# Altium schematic sheet Sheet_1_2022-06-09.schdoc
size 54 x 32 mm
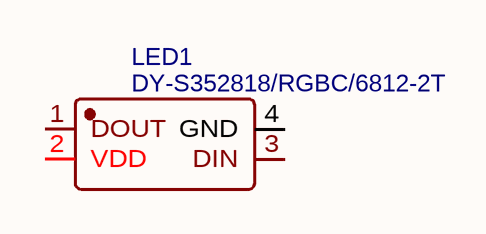
[diagram p0: Sheet_1_2022-06-09.schdoc]

## Parts
LED1  DY-S352818/RGBC/6812-2T  [LED-SMD_L3.2-W2.8-BR_DY-S352818]

## Nets

Not connected (* = marked no-connect by the designer): LED1 1(DOUT) 2(VDD) 3(DIN) 4(GND)

## Library data of the parts
LED1 = DY-S352818/RGBC/6812-2T: BOM_Manufacturer: TONYU; Contributor: LCSC; BOM_Supplier: LCSC; BOM_Supplier Part: C524051; BOM_Manufacturer Part: DY-S352818/RGBC/6812-2T; BOM_JLCPCB Part Class: Extended Part; spicePre: L; spiceSymbolName: DY-S352818/RGBC/6812-2T